# Altium schematic sheet Sheet7.SchDoc
size A3; DocumentNumber: 7; SheetNumber: 7; SheetTotal: 7
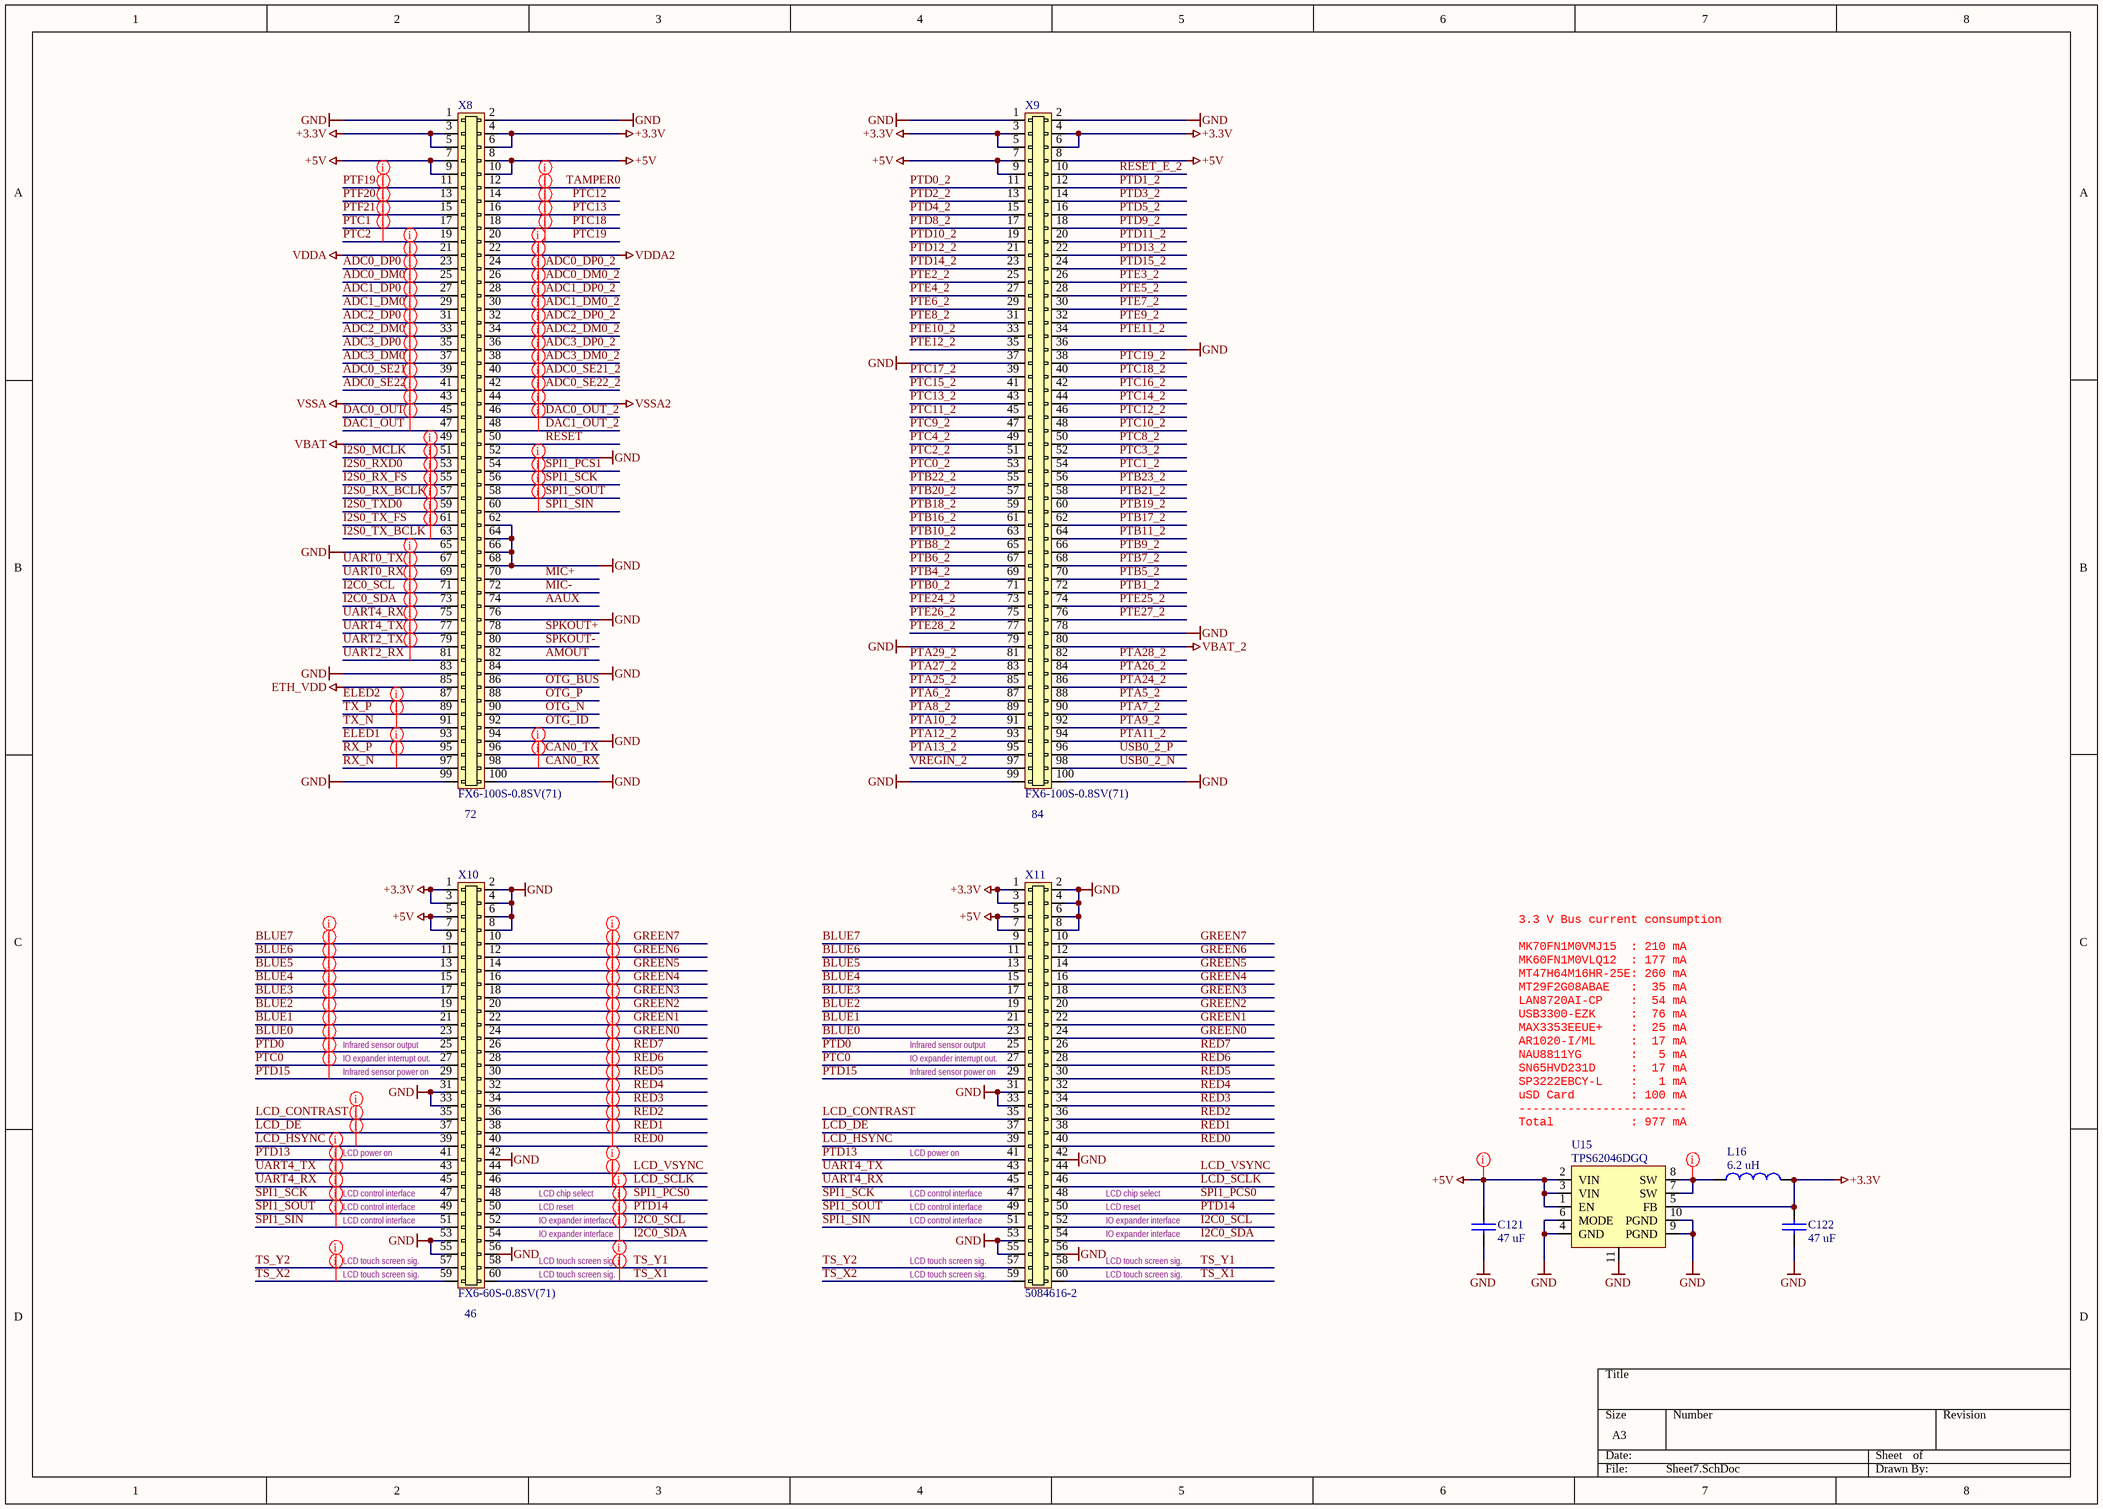
[diagram p0: Sheet7.SchDoc]

## Parts
C121  value 47 uF  [3225[1210]]  (hidden comment: GRM32ER71A476KE15L)
C122  value 47 uF  [3225[1210]]  (hidden comment: GRM32ER71A476KE15L)
L16  value 6.2 uH  [CDRH6D38]  (hidden comment: CDRH6D38NP-6R2NC)
U15  TPS62046DGQ  [TI-DGQ 10pin (R-PDSO-G10)]
X8  FX6-100S-0.8SV(71)  [FX6-100S-0.8SV(71)]
X9  FX6-100S-0.8SV(71)  [FX6-100S-0.8SV(71)]
X10  FX6-60S-0.8SV(71)  [FX6-60S-0.8SV(71)]
X11  5084616-2  [5084616-2]

## Nets
+3.3V: C122.1 L16.2 U15.5(FB) X8.3 X8.4 X8.5 X8.6 X9.3 X9.4 X9.5 X9.6 X10.1 X10.3 X11.1 X11.3
+5V: C121.1 U15.1(EN) U15.2(VIN) U15.3(VIN) X8.7 X8.8 X8.9 X8.10 X9.7 X9.8 X9.9 X10.5 X10.7 X11.5 X11.7
ETH_VDD: X8.85
GND: C121.2 C122.2 U15.4(GND) U15.6(MODE) U15.9(PGND) U15.10(PGND) U15.11(PAD) X8.1 X8.2 X8.52 X8.62 X8.64 X8.65 X8.66 X8.68 X8.76 X8.83 X8.84 X8.94 X8.99 X8.100 X9.1 X9.2 X9.36 X9.37 X9.78 X9.79 X9.99 X9.100 X10.2 X10.4 X10.6 X10.8 X10.31 X10.33 X10.42 X10.53 X10.55 X10.56 X11.2 X11.4 X11.6 X11.8 X11.31 X11.33 X11.42 X11.53 X11.55 X11.56
VBAT: X8.49
VBAT_2: X9.80
VDDA: X8.21
VDDA2: X8.22
VSSA: X8.43
VSSA2: X8.44
AAUX: X8.74
ADC0_DM0: X8.25
ADC0_DM0_2: X8.26
ADC0_DP0: X8.23
ADC0_DP0_2: X8.24
ADC0_SE21: X8.39
ADC0_SE21_2: X8.40
ADC0_SE22: X8.41
ADC0_SE22_2: X8.42
ADC1_DM0: X8.29
ADC1_DM0_2: X8.30
ADC1_DP0: X8.27
ADC1_DP0_2: X8.28
ADC2_DM0: X8.33
ADC2_DM0_2: X8.34
ADC2_DP0: X8.31
ADC2_DP0_2: X8.32
ADC3_DM0: X8.37
ADC3_DM0_2: X8.38
ADC3_DP0: X8.35
ADC3_DP0_2: X8.36
AMOUT: X8.82
BLUE0: X10.23 X11.23
BLUE1: X10.21 X11.21
BLUE2: X10.19 X11.19
BLUE3: X10.17 X11.17
BLUE4: X10.15 X11.15
BLUE5: X10.13 X11.13
BLUE6: X10.11 X11.11
BLUE7: X10.9 X11.9
CAN0_RX: X8.98
CAN0_TX: X8.96
DAC0_OUT: X8.45
DAC0_OUT_2: X8.46
DAC1_OUT: X8.47
DAC1_OUT_2: X8.48
ELED1: X8.93
ELED2: X8.87
GREEN0: X10.24 X11.24
GREEN1: X10.22 X11.22
GREEN2: X10.20 X11.20
GREEN3: X10.18 X11.18
GREEN4: X10.16 X11.16
GREEN5: X10.14 X11.14
GREEN6: X10.12 X11.12
GREEN7: X10.10 X11.10
I2C0_SCL: X8.71 X10.52 X11.52
I2C0_SDA: X8.73 X10.54 X11.54
I2S0_MCLK: X8.51
I2S0_RX_BCLK: X8.57
I2S0_RX_FS: X8.55
I2S0_RXD0: X8.53
I2S0_TX_BCLK: X8.63
I2S0_TX_FS: X8.61
I2S0_TXD0: X8.59
LCD_CONTRAST: X10.35 X11.35
LCD_DE: X10.37 X11.37
LCD_HSYNC: X10.39 X11.39
LCD_SCLK: X10.46 X11.46
LCD_VSYNC: X10.44 X11.44
MIC+: X8.70
MIC-: X8.72
OTG_BUS: X8.86
OTG_ID: X8.92
OTG_N: X8.90
OTG_P: X8.88
PTA5_2: X9.88
PTA6_2: X9.87
PTA7_2: X9.90
PTA8_2: X9.89
PTA9_2: X9.92
PTA10_2: X9.91
PTA11_2: X9.94
PTA12_2: X9.93
PTA13_2: X9.95
PTA24_2: X9.86
PTA25_2: X9.85
PTA26_2: X9.84
PTA27_2: X9.83
PTA28_2: X9.82
PTA29_2: X9.81
PTB0_2: X9.71
PTB1_2: X9.72
PTB4_2: X9.69
PTB5_2: X9.70
PTB6_2: X9.67
PTB7_2: X9.68
PTB8_2: X9.65
PTB9_2: X9.66
PTB10_2: X9.63
PTB11_2: X9.64
PTB16_2: X9.61
PTB17_2: X9.62
PTB18_2: X9.59
PTB19_2: X9.60
PTB20_2: X9.57
PTB21_2: X9.58
PTB22_2: X9.55
PTB23_2: X9.56
PTC0: X10.27 X11.27
PTC0_2: X9.53
PTC1: X8.17
PTC1_2: X9.54
PTC2: X8.19
PTC2_2: X9.51
PTC3_2: X9.52
PTC4_2: X9.49
PTC8_2: X9.50
PTC9_2: X9.47
PTC10_2: X9.48
PTC11_2: X9.45
PTC12: X8.14
PTC12_2: X9.46
PTC13: X8.16
PTC13_2: X9.43
PTC14_2: X9.44
PTC15_2: X9.41
PTC16_2: X9.42
PTC17_2: X9.39
PTC18: X8.18
PTC18_2: X9.40
PTC19: X8.20
PTC19_2: X9.38
PTD0: X10.25 X11.25
PTD0_2: X9.11
PTD1_2: X9.12
PTD2_2: X9.13
PTD3_2: X9.14
PTD4_2: X9.15
PTD5_2: X9.16
PTD8_2: X9.17
PTD9_2: X9.18
PTD10_2: X9.19
PTD11_2: X9.20
PTD12_2: X9.21
PTD13: X10.41 X11.41
PTD13_2: X9.22
PTD14: X10.50 X11.50
PTD14_2: X9.23
PTD15: X10.29 X11.29
PTD15_2: X9.24
PTE2_2: X9.25
PTE3_2: X9.26
PTE4_2: X9.27
PTE5_2: X9.28
PTE6_2: X9.29
PTE7_2: X9.30
PTE8_2: X9.31
PTE9_2: X9.32
PTE10_2: X9.33
PTE11_2: X9.34
PTE12_2: X9.35
PTE24_2: X9.73
PTE25_2: X9.74
PTE26_2: X9.75
PTE27_2: X9.76
PTE28_2: X9.77
PTF19: X8.11
PTF20: X8.13
PTF21: X8.15
RED0: X10.40 X11.40
RED1: X10.38 X11.38
RED2: X10.36 X11.36
RED3: X10.34 X11.34
RED4: X10.32 X11.32
RED5: X10.30 X11.30
RED6: X10.28 X11.28
RED7: X10.26 X11.26
RESET: X8.50
RESET_E_2: X9.10
RX_N: X8.97
RX_P: X8.95
SPI1_PCS0: X10.48 X11.48
SPI1_PCS1: X8.54
SPI1_SCK: X8.56 X10.47 X11.47
SPI1_SIN: X8.60 X10.51 X11.51
SPI1_SOUT: X8.58 X10.49 X11.49
SPKOUT+: X8.78
SPKOUT-: X8.80
TAMPER0: X8.12
TS_X1: X10.60 X11.60
TS_X2: X10.59 X11.59
TS_Y1: X10.58 X11.58
TS_Y2: X10.57 X11.57
TX_N: X8.91
TX_P: X8.89
UART0_RX: X8.69
UART0_TX: X8.67
UART2_RX: X8.81
UART2_TX: X8.79
UART4_RX: X8.75 X10.45 X11.45
UART4_TX: X8.77 X10.43 X11.43
USB0_2_N: X9.98
USB0_2_P: X9.96
VREGIN_2: X9.97
NetL16_1: L16.1 U15.7(SW) U15.8(SW)

## Layout directives
net class LCD: BLUE0, BLUE1, BLUE2, BLUE3, BLUE4, BLUE5, BLUE6, BLUE7, GREEN0, GREEN1, GREEN2, GREEN3, GREEN4, GREEN5, GREEN6, GREEN7, LCD_CONTRAST, LCD_DE, LCD_HSYNC, LCD_SCLK, LCD_VSYNC, RED0, RED1, RED2, RED3, RED4, RED5, RED6, RED7, SPI1_SCK, SPI1_SIN, SPI1_SOUT
net class LCD_MISC: I2C0_SCL, I2C0_SDA, PTC0, PTD0, PTD13, PTD14, PTD15, SPI1_PCS0, TS_X1, TS_X2, TS_Y1, TS_Y2, UART4_RX, UART4_TX
net class GPIO_1: PTC1, PTC2, PTC12, PTC13, PTC18, PTC19, PTF19, PTF20, PTF21, TAMPER0
net class ANALOG1: ADC0_DM0, ADC0_DP0, ADC0_SE21, ADC0_SE22, ADC1_DM0, ADC1_DP0, ADC2_DM0, ADC2_DP0, ADC3_DM0, ADC3_DP0, DAC0_OUT, DAC1_OUT, VDDA, VSSA
net class ANALOG2: ADC0_DM0_2, ADC0_DP0_2, ADC0_SE21_2, ADC0_SE22_2, ADC1_DM0_2, ADC1_DP0_2, ADC2_DM0_2, ADC2_DP0_2, ADC3_DM0_2, ADC3_DP0_2, DAC0_OUT_2, DAC1_OUT_2, VDDA2, VSSA2
net class ETH_TX: TX_N, TX_P
net class ETH_RX: RX_N, RX_P
net class INTF1: CAN0_RX, CAN0_TX, I2C0_SCL, I2C0_SDA, SPI1_PCS1, SPI1_SCK, SPI1_SIN, SPI1_SOUT, UART0_RX, UART0_TX, UART2_RX, UART2_TX, UART4_RX, UART4_TX
net class I2S0_1: I2S0_MCLK, I2S0_RX_BCLK, I2S0_RX_FS, I2S0_RXD0, I2S0_TX_BCLK, I2S0_TX_FS, I2S0_TXD0
net class HV: +5V, NetL16_1

## Notes on the sheet
- (near X8) 72
- (near X9) 84
- (near X10) Infrared sensor output
- (near X11) Infrared sensor output
- (near X10) Infrared sensor power on
- (near X10) IO expander interrupt out.
- (near X11) Infrared sensor power on
- (near X11) IO expander interrupt out.
- 3.3 V Bus current consumption
  MK70FN1M0VMJ15  : 210 mA
  MK60FN1M0VLQ12  : 177 mA
  MT47H64M16HR-25E: 260 mA
  MT29F2G08ABAE   :  35 mA
  LAN8720AI-CP    :  54 mA
  USB3300-EZK     :  76 mA
  MAX3353EEUE+    :  25 mA
  AR1020-I/ML     :  17 mA
  NAU8811YG       :   5 mA
  SN65HVD231D     :  17 mA
  SP3222EBCY-L    :   1 mA
  uSD Card        : 100 mA
  ------------------------
  Total           : 977 mA
- LCD power on
- (near X10) LCD touch screen sig.
- (near X10) LCD control interface
- LCD reset
- LCD touch screen sig.
- LCD chip select
- IO expander interface
- (near X11) LCD touch screen sig.
- (near X11) LCD control interface
- (near X10) 46

## Library data of the parts
C121 C122 = GRM32ER71A476KE15L: 47.0 uF, 10V, 10%, X7R, 1210; Manufacturer: Murata Electronics North America; PartNum: 490-5312-2-ND; Tolerance: 10%; Price: 3.3; Distributor: Digi-Key; Voltage: 10V; PartName: GRM32ER71A476KE15L
L16 = CDRH6D38NP-6R2NC: INDUCTOR POWER 6.2UH 2.50A SMD; Manufacturer: Sumida America Components Inc; PartNum: 308-2315-1-ND; Tolerance: ±30%; Distributor: Digi-Key; Price: 0.71$; PartName: CDRH6D38NP-6R2NC
U15 = TPS62046DGQ: REG BUCK SYNC 3.3V , 2.5..6V, 1.2A, -40..85 C, 10MSOP; Manufacturer: Texas Instruments; PartNum: 296-27023-5-ND; Distributor: Digi-Key; price: 3.1$; PartName: TPS62046DGQ
X8 X9 = FX6-100S-0.8SV(71): RECEPT 100POS .8MM SMD GOLD, 5mm, 6mm, 7 mm; Manufacturer: Hirose Electric Co Ltd; PartNum: H10808-ND; Price: 5.7$; Distributor: Digi-Key; PartName: FX6-100S-0.8SV(71)
X10 = FX6-60S-0.8SV(71): RECEPT 60POS .8MM W/BOSS; Manufacturer: Hirose Electric Co Ltd; PartNum: H10806-ND; Price: 3.7$; Distributor: DigiKey; PartName: FX6-60S-0.8SV(71)
X11 = 5084616-2: Free Height (FH) Connectors 60P 13mm RECEPTACLE STACK HEIGHT 13-16mm; Manufacturer: Tyco Electronics / AMP; PartNum: A99235CT-ND; Ordered: Digi-Key; Price: 6.47$; Distributor: Digi-Key; PartName: 5084616-2; Price50: 5.66$; Price100: 5.39$; Price1000: 2.41$